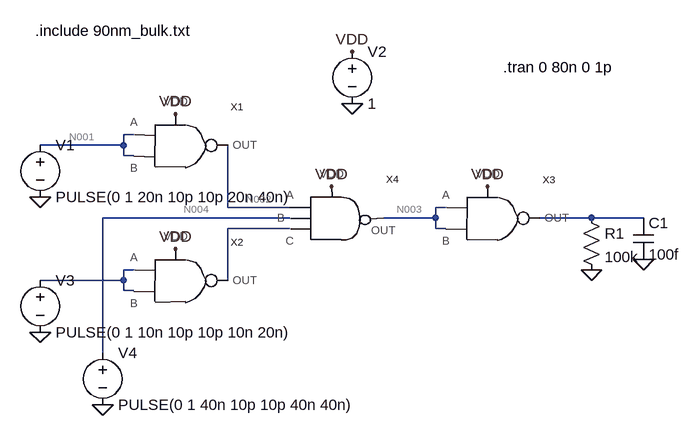
[diagram p0: schematic 1_exp4.asc]
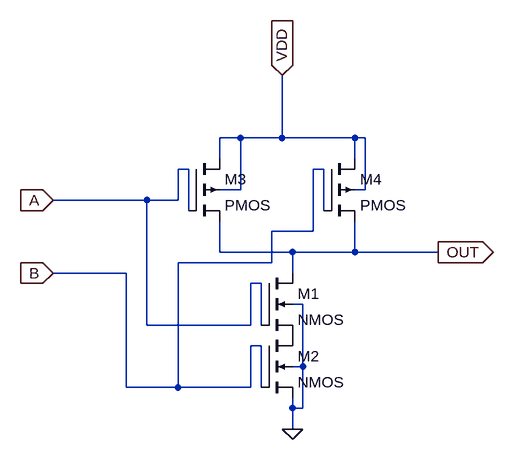
[diagram p1: sub-circuit nand.asc]
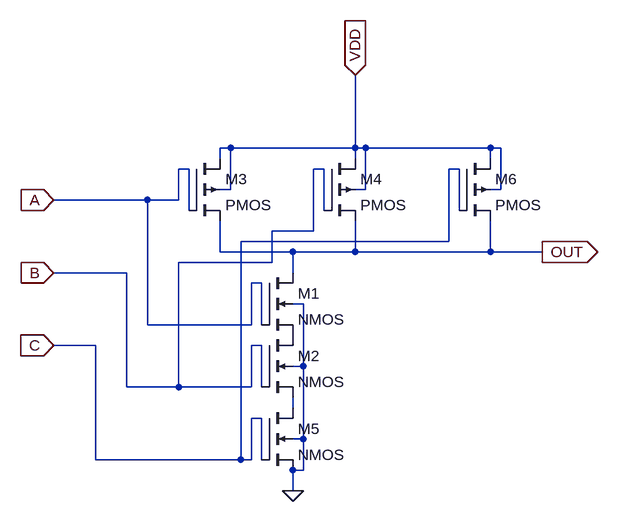
[diagram p2: sub-circuit nand3.asc]
1_exp4.asc, the LTspice schematic file:
Version 4
SHEET 1 892 680
WIRE 48 96 32 96
WIRE 32 112 32 96
WIRE 32 112 -96 112
WIRE 32 128 32 112
WIRE 48 128 32 128
WIRE 192 208 192 112
WIRE 288 208 192 208
WIRE 528 208 512 208
WIRE 288 224 0 224
WIRE 512 224 512 208
WIRE 512 224 432 224
WIRE 752 224 672 224
WIRE 832 224 752 224
WIRE 288 240 192 240
WIRE 512 240 512 224
WIRE 528 240 512 240
WIRE 48 304 32 304
WIRE 32 320 32 304
WIRE 32 320 -96 320
WIRE 192 320 192 240
WIRE 32 336 32 320
WIRE 48 336 32 336
WIRE 0 432 0 224
FLAG -96 192 0
FLAG 384 48 0
FLAG -96 400 0
FLAG 0 512 0
FLAG 752 304 0
FLAG 832 288 0
FLAG 112 64 VDD
FLAG 112 272 VDD
FLAG 352 176 VDD
FLAG 384 -32 VDD
FLAG 592 176 VDD
SYMBOL nand 112 112 R0
SYMATTR InstName X1
SYMBOL nand 112 320 R0
SYMATTR InstName X2
SYMBOL nand 592 224 R0
SYMATTR InstName X3
SYMBOL nand3 336 224 R0
SYMATTR InstName X4
SYMBOL res 736 208 R0
SYMATTR InstName R1
SYMATTR Value 100k
SYMBOL cap 816 224 R0
SYMATTR InstName C1
SYMATTR Value 100f
SYMBOL voltage -96 96 R0
WINDOW 123 0 0 Left 2
WINDOW 39 0 0 Left 2
SYMATTR InstName V1
SYMATTR Value PULSE(0 1 20n 10p 10p 20n 40n)
SYMBOL voltage 384 -48 R0
WINDOW 123 0 0 Left 2
WINDOW 39 0 0 Left 2
SYMATTR InstName V2
SYMATTR Value 1
SYMBOL voltage -96 304 R0
WINDOW 123 0 0 Left 2
WINDOW 39 0 0 Left 2
SYMATTR InstName V3
SYMATTR Value PULSE(0 1 10n 10p 10p 10n 20n)
SYMBOL voltage 0 416 R0
WINDOW 123 0 0 Left 2
WINDOW 39 0 0 Left 2
SYMATTR InstName V4
SYMATTR Value PULSE(0 1 40n 10p 10p 40n 40n)
TEXT -104 -64 Left 2 !.include 90nm_bulk.txt
TEXT 616 -8 Left 2 !.tran 0 80n 0 1p

nand.asc, the sub-circuit schematic file:
Version 4
SHEET 1 880 680
WIRE 144 -80 112 -80
WIRE 208 -80 208 -176
WIRE 208 -80 144 -80
WIRE 320 -80 208 -80
WIRE 336 -80 320 -80
WIRE 112 -48 112 -80
WIRE 320 -48 320 -80
WIRE 64 -32 48 -32
WIRE 272 -32 256 -32
WIRE 144 0 144 -80
WIRE 144 0 112 0
WIRE 336 0 336 -80
WIRE 336 0 320 0
WIRE 0 16 -144 16
WIRE 48 16 48 -32
WIRE 48 16 0 16
WIRE 64 32 64 -32
WIRE 272 32 272 -32
WIRE 256 64 256 -32
WIRE 256 64 192 64
WIRE 112 96 112 48
WIRE 224 96 112 96
WIRE 320 96 320 48
WIRE 320 96 224 96
WIRE 448 96 320 96
WIRE 192 112 192 64
WIRE 192 112 48 112
WIRE -32 128 -144 128
WIRE 224 128 224 96
WIRE 176 144 160 144
WIRE 240 176 224 176
WIRE 0 208 0 16
WIRE 160 208 160 144
WIRE 160 208 0 208
WIRE 176 208 176 144
WIRE 176 240 160 240
WIRE 240 272 240 176
WIRE 240 272 224 272
WIRE -32 304 -32 128
WIRE 48 304 48 112
WIRE 48 304 -32 304
WIRE 160 304 160 240
WIRE 160 304 48 304
WIRE 176 304 176 240
WIRE 224 336 224 320
WIRE 240 336 240 272
WIRE 240 336 224 336
WIRE 224 368 224 336
FLAG 224 368 0
FLAG 448 96 OUT
IOPIN 448 96 Out
FLAG -144 16 A
IOPIN -144 16 In
FLAG -144 128 B
IOPIN -144 128 In
FLAG 208 -176 VDD
IOPIN 208 -176 In
SYMBOL nmos4 176 128 R0
SYMATTR InstName M1
SYMATTR Value2 l=90n w=200n
SYMBOL nmos4 176 224 R0
SYMATTR InstName M2
SYMATTR Value2 l=90n w=200n
SYMBOL pmos4 64 -48 R0
SYMATTR InstName M3
SYMATTR Value2 l=90n w=400n
SYMBOL pmos4 272 -48 R0
SYMATTR InstName M4
SYMATTR Value2 l=90n w=400n

nand3.asc, the sub-circuit schematic file:
Version 4
SHEET 1 880 680
WIRE 96 32 80 32
WIRE 288 32 288 -80
WIRE 288 32 96 32
WIRE 304 32 288 32
WIRE 496 32 304 32
WIRE 512 32 496 32
WIRE 80 48 80 32
WIRE 288 48 288 32
WIRE 496 48 496 32
WIRE 32 64 16 64
WIRE 240 64 224 64
WIRE 448 64 432 64
WIRE 96 96 96 32
WIRE 96 96 80 96
WIRE 304 96 304 32
WIRE 304 96 288 96
WIRE 512 96 512 32
WIRE 512 96 496 96
WIRE -32 112 -176 112
WIRE 16 112 16 64
WIRE 16 112 -32 112
WIRE 32 128 32 64
WIRE 240 128 240 64
WIRE 448 128 448 64
WIRE 224 160 224 64
WIRE 224 160 160 160
WIRE 432 176 432 64
WIRE 432 176 112 176
WIRE 80 192 80 144
WIRE 192 192 80 192
WIRE 288 192 288 144
WIRE 288 192 192 192
WIRE 496 192 496 144
WIRE 496 192 288 192
WIRE 576 192 496 192
WIRE 160 208 160 160
WIRE 160 208 16 208
WIRE -64 224 -176 224
WIRE 192 224 192 192
WIRE 144 240 128 240
WIRE 208 272 192 272
WIRE -32 304 -32 112
WIRE 128 304 128 240
WIRE 128 304 -32 304
WIRE 144 304 144 240
WIRE -112 336 -176 336
WIRE 144 336 128 336
WIRE 208 368 208 272
WIRE 208 368 192 368
WIRE -64 400 -64 224
WIRE 16 400 16 208
WIRE 16 400 -64 400
WIRE 128 400 128 336
WIRE 128 400 16 400
WIRE 144 400 144 336
WIRE 192 432 192 416
WIRE 144 448 128 448
WIRE 208 480 208 368
WIRE 208 480 192 480
WIRE -112 512 -112 336
WIRE 112 512 112 176
WIRE 112 512 -112 512
WIRE 128 512 128 448
WIRE 128 512 112 512
WIRE 144 512 144 448
WIRE 208 528 208 480
WIRE 208 528 192 528
WIRE 192 560 192 528
FLAG -176 112 A
IOPIN -176 112 In
FLAG -176 224 B
IOPIN -176 224 In
FLAG 192 560 0
FLAG 576 192 OUT
IOPIN 576 192 Out
FLAG -176 336 C
IOPIN -176 336 In
FLAG 288 -80 VDD
IOPIN 288 -80 In
SYMBOL nmos4 144 224 R0
SYMATTR InstName M1
SYMATTR Value2 l=90n w=200n
SYMBOL nmos4 144 320 R0
SYMATTR InstName M2
SYMATTR Value2 l=90n w=200n
SYMBOL pmos4 32 48 R0
SYMATTR InstName M3
SYMATTR Value2 l=90n w=400n
SYMBOL pmos4 240 48 R0
SYMATTR InstName M4
SYMATTR Value2 l=90n w=400n
SYMBOL nmos4 144 432 R0
SYMATTR InstName M5
SYMATTR Value2 l=90n w=200n
SYMBOL pmos4 448 48 R0
SYMATTR InstName M6
SYMATTR Value2 l=90n w=400n

The netlist it stands for:
* 1_exp4.asc
XX1 N001 N001 N002 VDD nand
XX2 N007 N007 N006 VDD nand
XX3 N003 N003 N005 VDD nand
XX4 N002 N004 N006 VDD N003 nand3
R1 N005 0 100k
C1 N005 0 100f
V1 N001 0 PULSE(0 1 20n 10p 10p 20n 40n)
V2 VDD 0 1
V3 N007 0 PULSE(0 1 10n 10p 10p 10n 20n)
V4 N004 0 PULSE(0 1 40n 10p 10p 40n 40n)

* block symbol definitions
.subckt nand A B OUT VDD
M1 OUT A P001 0 NMOS l=90n w=200n
M2 P001 B 0 0 NMOS l=90n w=200n
M3 VDD A OUT VDD PMOS l=90n w=400n
M4 VDD B OUT VDD PMOS l=90n w=400n
.ends nand

.subckt nand3 A B C VDD OUT
M1 OUT A P001 0 NMOS l=90n w=200n
M2 P001 B N001 0 NMOS l=90n w=200n
M3 VDD A OUT VDD PMOS l=90n w=400n
M4 VDD B OUT VDD PMOS l=90n w=400n
M5 N001 C 0 0 NMOS l=90n w=200n
M6 VDD C OUT VDD PMOS l=90n w=400n
.ends nand3

.model NMOS NMOS
.model PMOS PMOS
.lib standard.mos
.include 90nm_bulk.txt
.tran 0 80n 0 1p
.backanno
.end

* Results of the author's LTspice run, read from the files saved beside the schematic
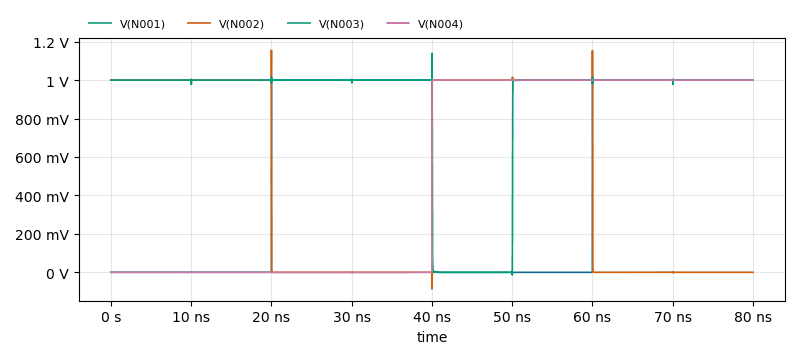
[diagram p3: Transient Analysis of 1_exp4.asc, plotted from the saved traces]
* Transient Analysis, 1 run:
*   V(N001): min 0 V, max 1 V, average 500.1 mV, rms 707.1 mV, last 1 V
*   V(N002): min -85.66 mV, max 1.155 V, average 500.3 mV, rms 707.3 mV, last 46.42 µV
*   V(N003): min -13.76 mV, max 1.139 V, average 875.2 mV, rms 935.4 mV, last 1 V
*   V(N004): min 0 V, max 1 V, average 499.9 mV, rms 707 mV, last 1 V